# Altium schematic sheet VESC_KS75600_comm.SchDoc
size A4; SheetNumber: 5; SheetTotal: 5
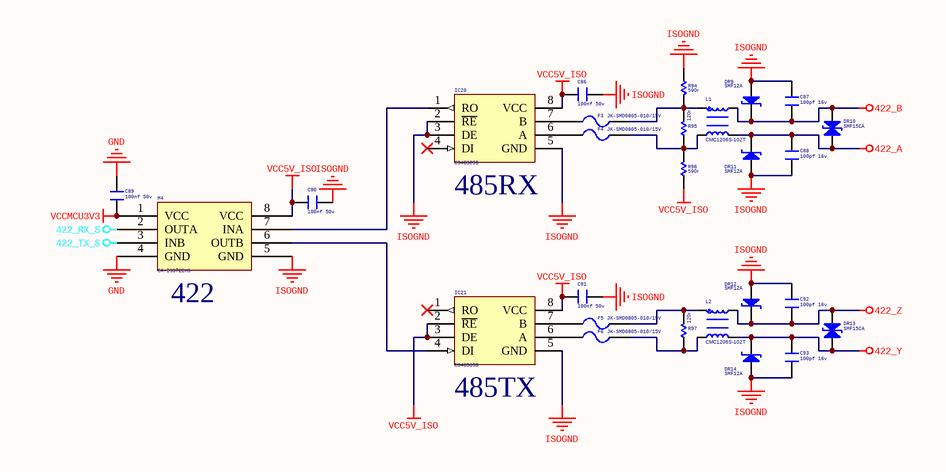
[diagram p0: VESC_KS75600_comm.SchDoc]

## Parts
C86  100nf 50v  [C 0603]
C87  100pf 16v  [C 0603]
C88  100pf 16v  [C 0603]
C89  100nf 50v  [C 0603]
C90  100nf 50v  [C 0603]
C91  100nf 50v  [C 0603]
C92  100pf 16v  [C 0603]
C93  100pf 16v  [C 0603]
DR9  SMF12A  [SOD-123F]
DR10  SMF15CA  [SOD-123F]
DR11  SMF12A  [SOD-123F]
DR12  SMF12A  [SOD-123F]
DR13  SMF15CA  [SOD-123F]
DR14  SMF12A  [SOD-123F]
F3  JK-SMD0805-010/15V  [FU 0805]
F4  JK-SMD0805-010/15V  [FU 0805]
F5  JK-SMD0805-010/15V  [FU 0805]
F6  JK-SMD0805-010/15V  [FU 0805]
IC20  CS48505S  [SOP8_N]
IC21  CS48505S  [SOP8_N]
L1  CMC1206S-102T  [D_C_C_1206]
L2  CMC1206S-102T  [D_C_C_1206]
M4  CA-IS3722HS  [SOP8_N]
R94  590r  [R 0603]
R95  120r  [R 0603]
R96  590r  [R 0603]
R97  120r  [R 0603]

## Nets
422_A: C88.2 DR10.2(K) DR11.2(K) L1.3
422_B: C87.2 DR9.2(K) DR10.1(A) L1.2
422_RX_S: M4.2(OUTA)
422_TX_S: M4.3(INB)
422_Y: C93.2 DR13.2(K) DR14.2(K) L2.3
422_Z: C92.2 DR12.2(K) DR13.1(A) L2.2
GND: C89.1 M4.4(GND)
ISOGND: C86.2 C87.1 C88.1 C90.2 C91.2 C92.1 C93.1 DR9.1(A) DR11.1(A) DR12.1(A) DR14.1(A) IC20.2(~{RE}) IC20.3(DE) IC20.5(GND) IC21.5(GND) M4.5(GND) R94.1
VCC5V_ISO: C86.1 C90.1 C91.1 IC20.8(VCC) IC21.2(~{RE}) IC21.3(DE) IC21.8(VCC) M4.8(VCC) R96.1
VCCMCU3V3: C89.2 M4.1(VCC)
NetF3_1: F3.1 IC20.7(B)
NetF3_2: F3.2 L1.1 R94.2 R95.2
NetF4_1: F4.1 IC20.6(A)
NetF4_2: F4.2 L1.4 R95.1 R96.2
NetF5_1: F5.1 IC21.7(B)
NetF5_2: F5.2 L2.1 R97.2
NetF6_1: F6.1 IC21.6(A)
NetF6_2: F6.2 L2.4 R97.1
NetIC20_1: IC20.1(RO) M4.7(INA)
NetIC21_4: IC21.4(DI) M4.6(OUTB)

Not connected (* = marked no-connect by the designer): IC20 4(DI)*; IC21 1(RO)*

## Notes on the sheet
- (near IC20) 485RX
- (near M4) 422
- (near IC21) 485TX

## Library data of the parts
C86-C93 = C: 无极性贴片电容
  C86 C89-C91: Voltage: 50v; Value: 100nf
  C87 C88 C92 C93: Voltage: 16v; Value: 100pf
DR9 DR11 DR12 DR14 = DR_S: 瞬态电压抑制二极管(单向)
DR10 DR13 = DR: 瞬态电压抑制二极管
F3-F6 = FU: 贴片保险丝
IC20 IC21 = SP3485: RS485总线收发芯片
L1 L2 = L-CMC: 共模电感; Value: CMC1206S-102T
M4 = CA-IS3722: 正反向数字隔离器
R94-R97 = R: 贴片电阻
  R94 R96: Value: 590r
  R95 R97: Value: 120r